# EAGLE design Nixie (EAGLE 6.5.0)
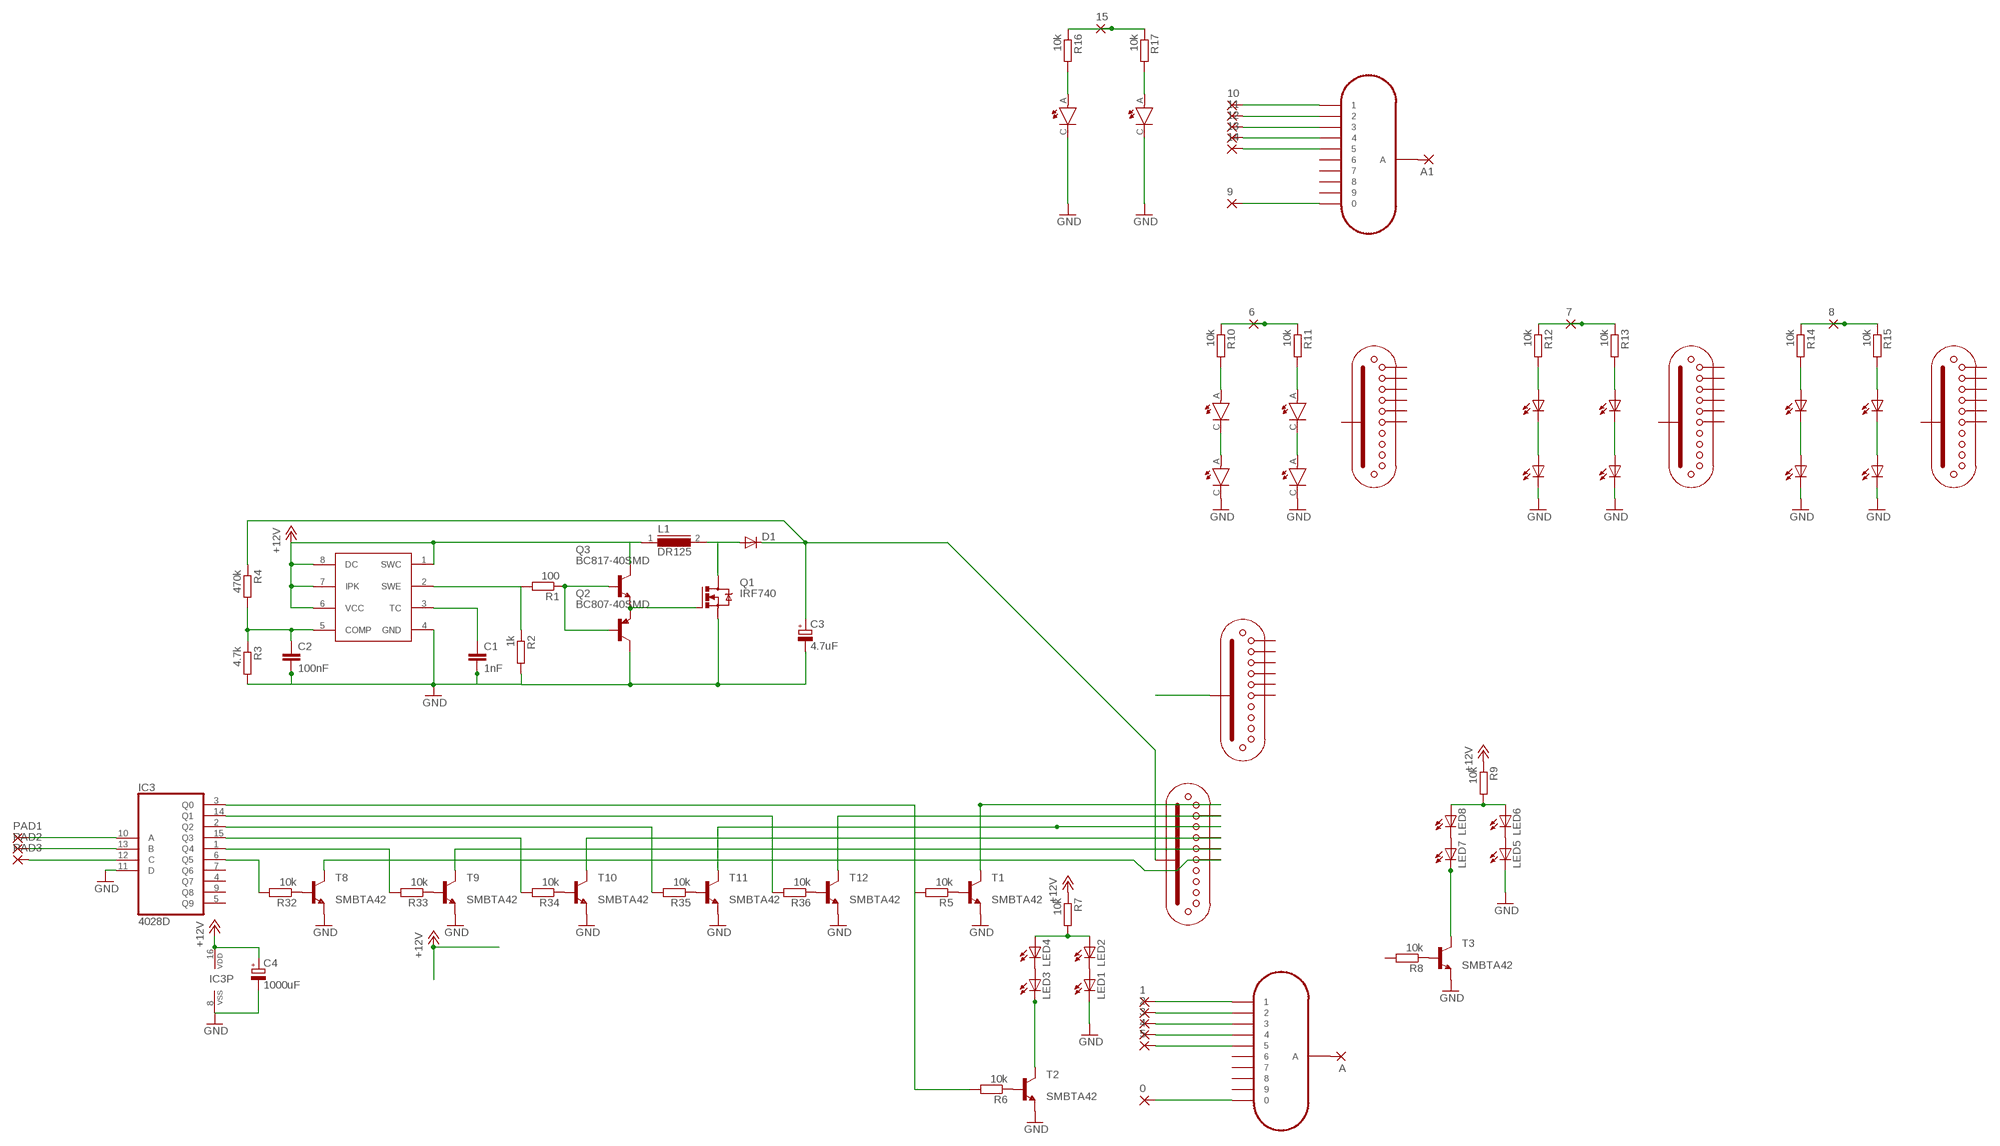
[diagram p0: schematic, sheet 1]

## Parts
0  SMD2  [SMD1,27-2,54]
1  SMD2  [SMD1,27-2,54]
2  SMD2  [SMD1,27-2,54]
3  SMD2  [SMD1,27-2,54]
4  SMD2  [SMD1,27-2,54]
5  SMD2  [SMD1,27-2,54]
6  SMD2  [SMD1,27-2,54]
7  SMD2  [SMD1,27-2,54]
8  SMD2  [SMD1,27-2,54]
9  SMD2  [SMD1,27-2,54]
10  SMD2  [SMD1,27-2,54]
11  SMD2  [SMD1,27-2,54]
12  SMD2  [SMD1,27-2,54]
13  SMD2  [SMD1,27-2,54]
14  SMD2  [SMD1,27-2,54]
15  SMD2  [SMD1,27-2,54]
A  SMD2  [SMD1,27-2,54]
A1  SMD2  [SMD1,27-2,54]
C1  1nF  C-EUC0805K  [C0805K]
C2  100nF  C-EUC0805K  [C0805K]
C3  4.7uF  CPOL-EUE5-10.5  [E5-10,5]
C4  1000uF  CPOL-EUE5-10.5  [E5-10,5]
D1  DIODE-DO214AC  [DO214AC]
IC3  4028D  [SO16]
L1  DR125  [DR125]
LED1  LED3MM  [LED3MM]
LED2  LED3MM  [LED3MM]
LED3  LED3MM  [LED3MM]
LED4  LED3MM  [LED3MM]
LED5  LED3MM  [LED3MM]
LED6  LED3MM  [LED3MM]
LED7  LED3MM  [LED3MM]
LED8  LED3MM  [LED3MM]
LED9  LED_PLCC6  [PLCC6]
LED10  LED_PLCC6  [PLCC6]
LED11  LED_PLCC6  [PLCC6]
LED12  LED_PLCC6  [PLCC6]
LED13  LED_LRTB_G6TG  [PLCC6]
LED14  LED_LRTB_G6TG  [PLCC6]
N1  IN-12A-IN-12  [IN-12]
N2  IN-12A-IN-12  [IN-12]
PAD1  1,6/0,8  [1,6/0,8]
PAD2  1,6/0,8  [1,6/0,8]
PAD3  1,6/0,8  [1,6/0,8]
Q1  IRF740  [TO220BV]
Q2  BC807-40SMD  [SOT23-BEC]
Q3  BC817-40SMD  [SOT23-BEC]
R1  100  R-EU_R0805  [R0805]
R2  1k  R-EU_R0805  [R0805]
R3  4.7k  R-EU_R0805  [R0805]
R4  470k  R-EU_R0805  [R0805]
R5  10k  R-EU_R0805  [R0805]
R6  10k  R-EU_R0805  [R0805]
R7  10k  R-EU_R0805  [R0805]
R8  10k  R-EU_R0805  [R0805]
R9  10k  R-EU_R0805  [R0805]
R10  10k  R-EU_R0805  [R0805]
R11  10k  R-EU_R0805  [R0805]
R12  10k  R-EU_R0805  [R0805]
R13  10k  R-EU_R0805  [R0805]
R14  10k  R-EU_R0805  [R0805]
R15  10k  R-EU_R0805  [R0805]
R16  10k  R-EU_R0805  [R0805]
R17  10k  R-EU_R0805  [R0805]
R32  10k  R-EU_R0805  [R0805]
R33  10k  R-EU_R0805  [R0805]
R34  10k  R-EU_R0805  [R0805]
R35  10k  R-EU_R0805  [R0805]
R36  10k  R-EU_R0805  [R0805]
T1  MMBTA42LT1-NPN-SOT23-BEC  [SOT23-BEC]
T2  MMBTA42LT1-NPN-SOT23-BEC  [SOT23-BEC]
T3  MMBTA42LT1-NPN-SOT23-BEC  [SOT23-BEC]
T8  MMBTA42LT1-NPN-SOT23-BEC  [SOT23-BEC]
T9  MMBTA42LT1-NPN-SOT23-BEC  [SOT23-BEC]
T10  MMBTA42LT1-NPN-SOT23-BEC  [SOT23-BEC]
T11  MMBTA42LT1-NPN-SOT23-BEC  [SOT23-BEC]
T12  MMBTA42LT1-NPN-SOT23-BEC  [SOT23-BEC]
U$1  ZM1020  [ZM1020]
U$2  MC33063/MC34063D  [SO08]
U$3  ZM1020  [ZM1020]
U$4  PLCC2  [PLCC2]
U$5  PLCC2  [PLCC2]
U$6  ZM1020  [ZM1020]
U$7  PLCC2  [PLCC2]
U$8  PLCC2  [PLCC2]
U$9  ZM1020  [ZM1020]
U$10  PLCC2  [PLCC2]
U$11  ZM1020  [ZM1020]
U$12  PLCC2  [PLCC2]

## Nets
+12V: C4.+ IC3.16(VDD) L1.1 Q3.C R7.1 R9.1 U$2.1(SWC) U$2.6(VCC) U$2.7(IPK) U$2.8(DC)
GND: C1.2 C2.2 C3.- C4.- IC3.8(VSS) IC3.11(D) LED1.K(C) LED5.K(C) LED10.C3(C) LED12.C3(C) LED14.C2(G:C) LED14.C3(B:C) Q1.S Q2.C R2.2 R3.2 T1.E T2.E T3.E T8.E T9.E T10.E T11.E T12.E U$2.4(GND) U$7.C U$8.C U$10.C U$12.C
N$1: C1.1 U$2.3(TC)
N$2: IC3.10(A) PAD1.1(P)
N$3: IC3.13(B) PAD2.1(P)
N$4: D1.A L1.2 Q1.D
N$5: C2.1 R3.1 R4.2 U$2.5(COMP)
N$6: IC3.3(Q0) R5.2 R6.2
N$7: R1.2 R2.1 U$2.2(SWE)
N$8: C3.+ D1.C R4.1 U$1.12(A)
N$9: Q1.G Q2.E Q3.E
N$10: Q2.B Q3.B R1.1
N$11: IC3.12(C) PAD3.1(P)
N$12: R5.1 T1.B
N$13: T1.C U$1.11
N$14: LED1.A LED2.K(C)
N$15: LED3.A LED4.K(C)
N$16: U$3.12(A)
N$17: R6.1 T2.B
N$18: R32.1 T8.B
N$19: LED3.K(C) T2.C
N$20: LED2.A LED4.A R7.2
N$21: 0.1(P) N1.0
N$32: 1.1(P) N1.1
N$33: 2.1(P) N1.2
N$34: 3.1(P) N1.3
N$35: 4.1(P) N1.4
N$36: 5.1(P) N1.5
N$37: IC3.14(Q1) R36.2
N$38: IC3.2(Q2) R35.2
N$39: T10.C U$1.3
N$40: A.1(P) N1.A
N$41: LED5.A LED6.K(C)
N$42: LED7.A LED8.K(C)
N$43: R8.1 T3.B
N$44: LED7.K(C) T3.C
N$45: LED6.A LED8.A R9.2
N$50: T9.C U$1.4
N$51: R34.1 T10.B
N$52: U$4.C U$7.A
N$53: U$5.C U$8.A
N$54: R11.2 U$5.A
N$55: R10.2 U$4.A
N$56: R33.1 T9.B
N$57: R35.1 T11.B
N$58: 6.1(P) R10.1 R11.1
N$60: LED11.C3(C) LED12.A3(A)
N$61: IC3.6(Q5) R32.2
N$62: R36.1 T12.B
N$63: T8.C U$1.5
N$64: IC3.1(Q4) R33.2
N$65: IC3.15(Q3) R34.2
N$66: T11.C U$1.2
N$67: T12.C U$1.1
N$68: LED11.A3(A) R13.2
N$69: LED9.A3(A) R12.2
N$70: 7.1(P) R12.1 R13.1
N$79: LED9.C3(C) LED10.A3(A)
N$80: LED13.C2(G:C) LED14.A2(G:A)
N$81: LED13.C3(B:C) LED14.A3(B:A)
N$82: LED13.A3(B:A) R15.2
N$83: LED13.A2(G:A) R14.2
N$84: 8.1(P) R14.1 R15.1
N$87: 9.1(P) N2.0
N$88: 10.1(P) N2.1
N$89: 11.1(P) N2.2
N$90: 12.1(P) N2.3
N$91: 13.1(P) N2.4
N$92: 14.1(P) N2.5
N$93: A1.1(P) N2.A
N$96: R17.2 U$12.A
N$97: R16.2 U$10.A
N$98: 15.1(P) R16.1 R17.1
Unconnected: IC3.4(Q7) IC3.5(Q9) IC3.7(Q6) IC3.9(Q8) LED13.A1(R:A) LED13.C1(R:C) LED14.A1(R:A) LED14.C1(R:C) N1.6 N1.7 N1.8 N1.9 N2.6 N2.7 N2.8 N2.9 R8.2 U$3.1 U$3.2 U$3.3 U$3.4 U$3.5 U$3.11 U$6.1 U$6.2 U$6.3 U$6.4 U$6.5 U$6.11 U$6.12(A) U$9.1 U$9.2 U$9.3 U$9.4 U$9.5 U$9.11 U$9.12(A) U$11.1 U$11.2 U$11.3 U$11.4 U$11.5 U$11.11 U$11.12(A)

## Library data of the parts
0 1-15 A A1 = wirepad:SMD2: SMD PAD
C1 C2 = rcl:C-EU: CAPACITOR, European symbol
C3 C4 = rcl:CPOL-EU: POLARIZED CAPACITOR, European symbol
D1 = diode:DIODE-: DIODE
IC3 = 40xx:4028: BCD to decimal DECODER
L1 = inductors:DR125: High Power Density, High Efficiency, Shielded Inductors Source: coiltronics_dr_series.pdf
LED1-LED8 = led:LED: LED OSRAM: - CHIPLED LG R971, LG N971, LY N971, LG Q971, LY Q971, LO R971, LY R971 LH N974, LH R974 LS Q976, LO Q976, LY Q976 LO Q996 - Hyper CHIPLED LW Q18S LB Q993, LB Q99A, LB R99A - SideLED LS A670, LO A670, LY A670, LG A670, LP A670 LB A673, LV A673, LT A673, LW A673 LH A674 LY A675 LS A676, LA A676, LO A676, LY A676, LW A676 LS A679, LY A679, LG A679 - Hyper Micro SIDELED® LS Y876, LA Y876, LO Y876, LY Y876 LT Y87S - SmartLED LW L88C, LW L88S LB L89C, LB L89S, LG L890 LS L89K, LO L89K, LY L89K LS L896, LA L896, LO L896, LY L896 - TOPLED LS T670, LO T670, LY T670, LG T670, LP T670 LSG T670, LSP T670, LSY T670, LOP T670, LYG T670 LG T671, LOG T671, LSG T671 LB T673, LV T673, LT T673, LW T673 LH T674 LS T676, LA T676, LO T676, LY T676, LB T676, LH T676, LSB T676, LW T676 LB T67C, LV T67C, LT T67C, LS T67K, LO T67K, LY T67K, LW E67C LS E67B, LA E67B, LO E67B, LY E67B, LB E67C, LV E67C, LT E67C LW T67C LS T679, LY T679, LG T679 LS T770, LO T770, LY T770, LG T770, LP T770 LB T773, LV T773, LT T773, LW T773 LH T774 LS E675, LA E675, LY E675, LS T675 LS T776, LA T776, LO T776, LY T776, LB T776 LHGB T686 LT T68C, LB T68C - Hyper Mini TOPLED® LB M676 - Mini TOPLED Santana® LG M470 LS M47K, LO M47K, LY M47K Source: http://www.osram.convergy.de LUXEON: - LUMILED® LXK2-PW12-R00, LXK2-PW12-S00, LXK2-PW14-U00, LXK2-PW14-V00 LXK2-PM12-R00, LXK2-PM12-S00, LXK2-PM14-U00 LXK2-PE12-Q00, LXK2-PE12-R00, LXK2-PE12-S00, LXK2-PE14-T00, LXK2-PE14-U00 LXK2-PB12-K00, LXK2-PB12-L00, LXK2-PB12-M00, LXK2-PB14-N00, LXK2-PB14-P00, LXK2-PB14-Q00 LXK2-PR12-L00, LXK2-PR12-M00, LXK2-PR14-Q00, LXK2-PR14-R00 LXK2-PD12-Q00, LXK2-PD12-R00, LXK2-PD12-S00 LXK2-PH12-R00, LXK2-PH12-S00 LXK2-PL12-P00, LXK2-PL12-Q00, LXK2-PL12-R00 Source: www.luxeon.com KINGBRIGHT: KA-3528ASYC Source: www.kingbright.com
LED9-LED12 = LED_PLCC6:LED_PLCC6
LED13 LED14 = LED_RGB_PLCC6_G6TG:LED_LRTB_G6TG
N1 N2 = IN-12A:IN-12A
PAD1-PAD3 = wirepad:1,6/0,8: THROUGH-HOLE PAD
Q1 = transistor-power:IRF740: N-CHANNEL MOS FET
Q2 = transistor-pnp:BC807*: PNP Transistror
Q3 = transistor-npn:BC817*: NPN Transistor
R1-R17 R32-R36 = rcl:R-EU_: RESISTOR, European symbol
T1-T3 T8-T12 = transistor:*-NPN-: NPN Transistror BF959 corrected 2008.03.06; T: SMBTA42
U$1 U$3 U$6 U$9 U$11 = ZM1020:ZM1020
U$2 = MC33063_MC34063:MC33063/MC34063
U$4 U$5 U$7 U$8 U$10 U$12 = LED_PLCC2:PLCC2

## Board
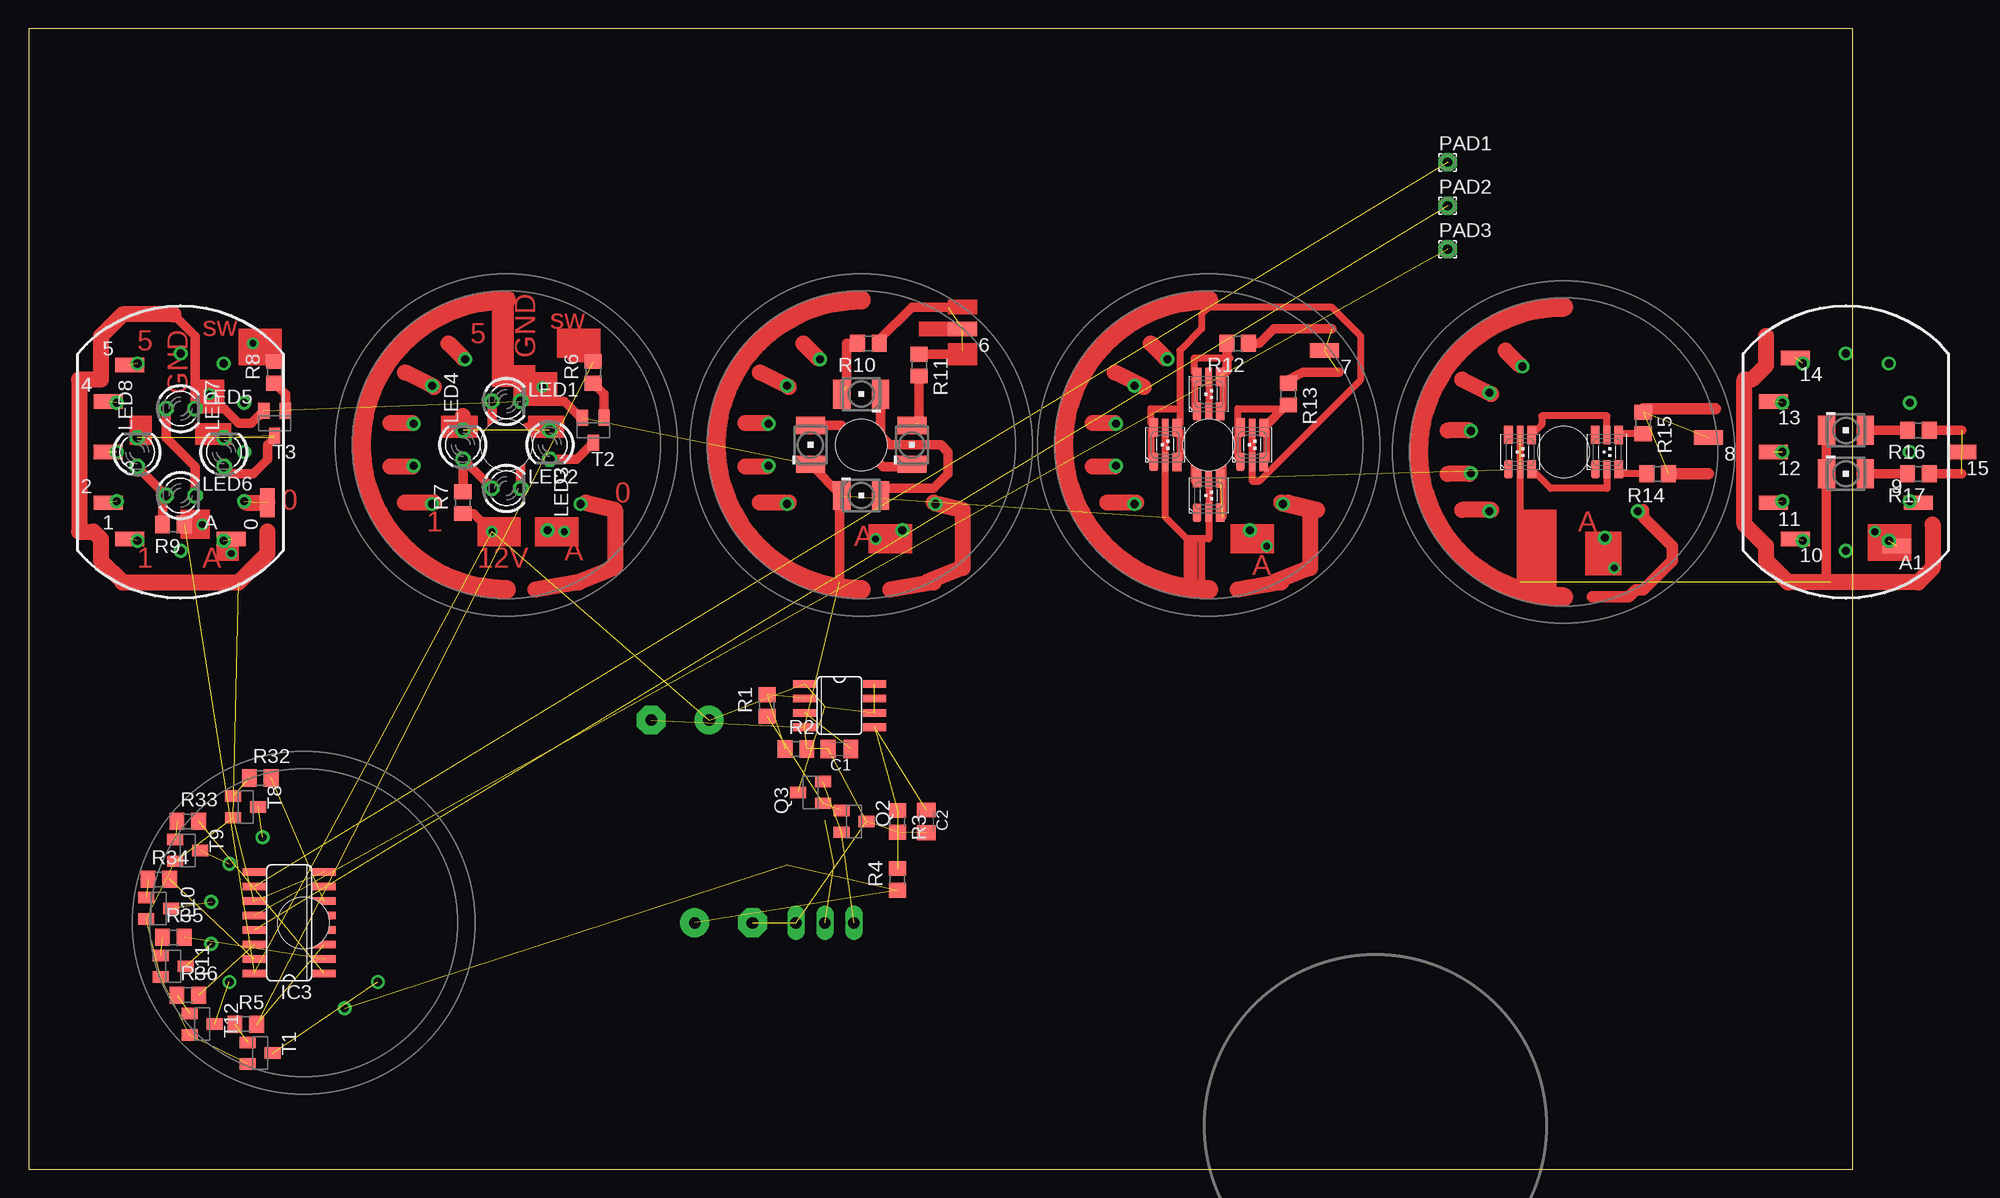
[diagram p1: board, top side]
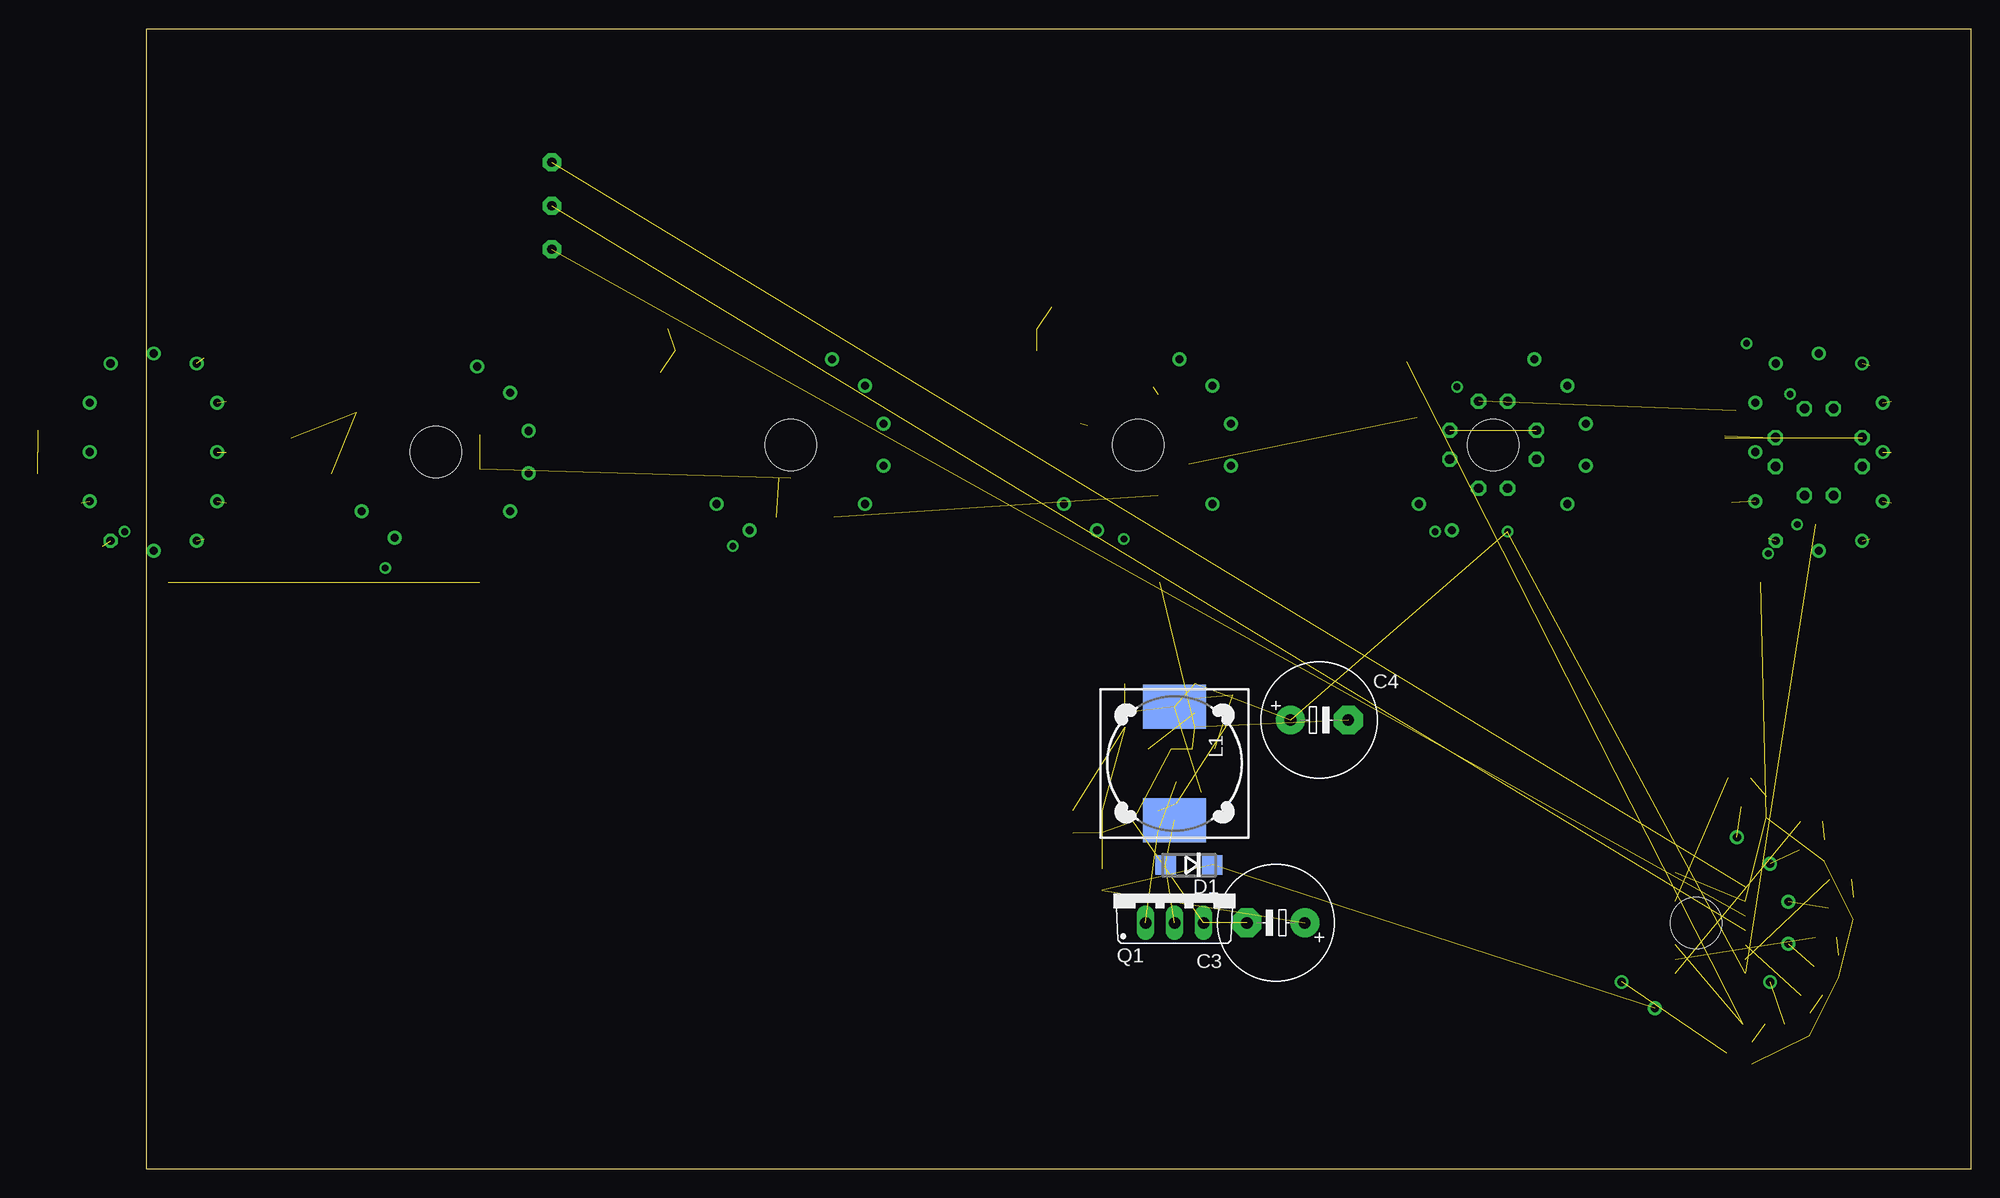
[diagram p2: board, bottom side, seen from below]

Size 160 x 100 mm. Coordinates in mm from the lower left corner, seen from the top.
Outline: 0,0 160,0 160,100 0,100 0,0
Copper layers (1*16): Top 0.035mm / dielectric 1.5mm / Bottom 0.035mm
Design rules "default": minimum track width 10mil, minimum drill 24mil, track to track 8mil, track to pad 8mil, pad to pad 8mil, via to via 8mil, smd to smd 8mil, copper to edge 40mil, drill to drill 8mil, minimum pad ring 10mil, minimum via ring 8mil, stop-mask expansion 4mil, vias tented up to drill 0mil, thermal gap 10mil

### Footprints (pad centres in the part's own frame; a part is rotated, then mirrored left to right if it is on the bottom)
SMD1,27-2,54 = smd 1.27 x 2.54: 1 0,0
C0805K = smd 1.3 x 1.6: 1 -1,0; 2 1,0
E5-10,5 = drill 1.016 pad 2.54: + -2.54,0 | drill 1.016 pad 2.54 octagon: - 2.54,0
DO214AC = smd 1.8 x 1.7: A 2.05,0; C -2.05,0
SO16 = smd 0.66 x 2.032: 1 -4.445,-3.073; 2 -3.175,-3.073; 3 -1.905,-3.073; 4 -0.635,-3.073; 5 0.635,-3.073; 6 1.905,-3.073; 7 3.175,-3.073; 8 4.445,-3.073; 9 4.445,3.073; 10 3.175,3.073; 11 1.905,3.073; 12 0.635,3.073; 13 -0.635,3.073; 14 -1.905,3.073; 15 -3.175,3.073; 16 -4.445,3.073
DR125 = smd 3.85 x 5.5: 1 -4.975,0; 2 4.975,0
LED3MM = drill 0.813 octagon: A -1.27,0; K 1.27,0
PLCC6 = smd 0.75 x 1.6: A1 -1.025,-1.5; A2 1.025,-1.5; A3 1.025,1.5; C1 -1.025,1.525 | smd 0.6 x 1.6: C2 0,-1.5; C3 0,1.5
IN-12 = drill 0.711: 0 5.59,-4.32; 1 -3.78,-7.766; 2 -5.59,-4.32; 3 -5.59,0; 4 -5.59,4.32; 5 -3.78,7.766; 6 0,8.64; 7 3.78,7.766; 8 5.59,4.32; 9 5.59,0; LHDP 0,-8.64 | drill 0.711 octagon: A 3.78,-7.766
1,6/0,8 = drill 0.813 pad 1.6 octagon: 1 0,0
TO220BV = drill 1.016 long: D 0,-2.54; G -2.54,-2.54; S 2.54,-2.54
SOT23-BEC = smd 1 x 1.4: B -0.95,-1.1; C 0,1.1; E 0.95,-1.1
R0805 = smd 1.3 x 1.5: 1 -0.95,0; 2 0.95,0
ZM1020 = drill 0.711: 1 -6.51,-5.19; 2 -8.12,-1.85; 3 -8.12,1.85; 4 -6.51,5.19; 5 -3.61,7.5; 11 6.51,-5.19; 12 3.61,-7.5 | hole 4.5: 0,0
SO08 = smd 0.66 x 2.032: 1 -1.905,-3.073; 2 -0.635,-3.073; 3 0.635,-3.073; 4 1.905,-3.073; 5 1.905,3.073; 6 0.635,3.073; 7 -0.635,3.073; 8 -1.905,3.073
PLCC2 = smd 2.54 x 1.524: A 0,1.702; C 0,-1.702

### Placement (x,y rotation side)
0  20.95,58.42 0 top
1  8.89,55.24 270 top
2  6.99,58.42 270 top
3  6.99,62.87 90 top
4  6.99,67.31 270 top
5  8.89,70.48 270 top
6  81.92,73.66 90 top
7  113.67,71.75 90 top
8  147.32,64.14 90 top
9  165.74,58.42 270 top  (outside the outline)
10  154.94,55.24 90 top
11  153.03,58.42 90 top
12  153.03,62.87 90 top
13  153.03,67.31 90 top
14  154.94,71.12 90 top
15  169.54,62.87 90 top  (outside the outline)
A  17.78,55.24 270 top
A1  163.83,54.61 90 top  (outside the outline)
C1  71.12,36.83 180 top
C2  78.74,30.48 270 top
C3  60.96,21.59 180 bottom
C4  57.15,39.37 0 bottom
D1  68.58,26.67 180 bottom
IC3  22.86,21.59 90 top
L1  69.85,35.56 270 bottom
LED1  41.91,67.31 0 top
LED2  41.91,59.69 0 top
LED3  45.72,63.5 270 top
LED4  38.1,63.5 90 top
LED5  13.34,66.67 0 top
LED6  13.34,59.05 0 top
LED7  17.14,62.87 90 top
LED8  9.53,62.87 90 top
LED9  103.5,67.94 0 top
LED10  103.5,59.05 0 top
LED11  107.31,63.5 0 top
LED12  99.69,63.5 0 top
LED13  138.43,62.87 0 top
LED14  130.81,62.87 0 top
N1  13.34,62.87 0 top
N2  159.38,62.87 0 top
PAD1  124.46,88.27 0 top
PAD2  124.46,84.45 0 top
PAD3  124.46,80.64 0 top
Q1  69.85,24.13 0 bottom
Q2  72.39,30.48 270 top
Q3  68.58,33.02 90 top
R1  64.77,40.64 90 top
R2  67.31,36.83 0 top
R3  76.2,30.48 270 top
R4  76.2,25.4 90 top
R5  19.05,12.7 0 top
R6  49.53,69.85 90 top
R7  38.1,58.42 90 top
R8  21.59,69.85 90 top
R9  12.7,56.52 180 top
R10  73.66,72.39 180 top
R11  78.11,70.48 270 top
R12  106.05,72.39 180 top
R13  110.49,67.94 270 top
R14  142.88,60.96 180 top
R15  141.6,65.41 270 top
R16  165.74,64.77 180 top  (outside the outline)
R17  165.74,60.96 180 top  (outside the outline)
R32  20.32,34.29 0 top
R33  13.97,30.48 0 top
R34  11.43,25.4 0 top
R35  12.7,20.32 0 top
R36  13.97,15.24 0 top
T1  20.32,10.16 270 top
T2  49.53,64.77 180 top
T3  21.59,65.41 180 top
T8  19.05,31.75 270 top
T9  13.97,27.94 270 top
T10  11.43,22.86 270 top
T11  12.7,17.78 270 top
T12  15.24,12.7 270 top
U$1  24.13,21.59 0 top
U$2  71.12,40.64 270 top
U$3  41.91,63.5 0 top
U$4  73.03,67.94 90 top
U$5  77.47,63.5 0 top
U$6  73.03,63.5 0 top
U$7  73.03,59.05 270 top
U$8  68.58,63.5 0 top
U$9  134.62,62.87 0 top
U$10  159.38,64.77 270 top
U$11  103.5,63.5 0 top
U$12  159.38,60.96 270 top

### Tracks (layer width: path | path; a pad name or v marks a point on that pad's centre or on a via)
+12V  (via drill 0.6)  (9 unrouted)
  Top 0.813: R7.1 39.05,57.47 v40.64,55.88
GND  (23 unrouted)
  Top 0.61: LED10.C3 103.5,55.24 102.87,55.24 | 102.87,55.24 102.23,55.24 | 101.6,55.24 99.69,57.15 LED12.C3 | 102.87,55.24 102.87,50.8 102.23,50.8 102.23,55.24 | 102.23,55.24 101.6,55.24 | 101.6,55.24 101.6,51.44 | LED14.C3 130.81,51.44
  Top 0.813: T2.E 48.43,65.87 46.99,67.31 LED1.K | T3.E 19.54,65.41 18.41,65.41 17.14,66.67 LED5.K 14.61,73.03 12.7,74.93 | 71.12,51.44 71.12,59.05 U$7.C U$8.C | U$10.C U$12.C 157.68,51.87 158.12,51.44
  Top 1.422: 12.7,74.93 8.26,74.93 6.35,73.03 6.35,69.22 4.45,69.22 4.45,55.88 5.71,55.88 6.35,55.24 6.35,53.34 8.26,51.44 18.41,51.44 20.95,53.98 20.95,55.88
N$1  (1 unrouted)
N$2  (1 unrouted)
N$3  (1 unrouted)
N$4  (2 unrouted)
N$5  (3 unrouted)
N$6  (2 unrouted)
N$7  (2 unrouted)
N$8  (3 unrouted)
N$9  (2 unrouted)
N$10  (2 unrouted)
N$11  (1 unrouted)
N$12  (1 unrouted)
N$13  (1 unrouted)
N$14
  Top 0.813: LED2.K 43.18,62.23 40.64,64.77 LED1.A
N$15  (1 unrouted)
  Top 1.422: LED4.K 38.1,66.04 | LED3.A 43.81,64.77
N$17
  Top 0.813: T2.B 50.48,67.95 R6.1
N$18  (1 unrouted)
N$19
  Top 0.813: LED3.K 48.09,62.23 T2.C
N$20
  Top 0.813: LED2.A LED4.A R7.2
N$21  (1 unrouted)
  Top 1.422: 19.05,58.42 0.1
N$22  (via drill 0.6)
  other vias: 46.99,55.88 74.3,55.24 108.58,54.61 139.06,52.7 161.93,55.88
N$23
  Top 0.813: 49.53,71.12 47.62,71.12 48.9,71.75
N$24
  Top 1.676: 41.91,50.8 arc-180 41.91,76.2 | 73.03,50.8 arc-180 73.03,76.2 | 103.5,50.8 arc-180 103.5,76.2 | 134.62,50.16 arc-180 134.62,75.56
N$25
  Top 1.422: 38.1,71.12 36.83,72.39 | 69.22,71.12 67.94,72.39 | 99.69,71.12 98.42,72.39 | 130.81,70.48 129.54,71.75
N$26
  Top 1.422: 35.56,68.58 33.02,69.85 | 66.67,68.58 64.14,69.85 | 97.79,68.58 95.25,69.85 | 128.27,67.94 125.73,69.22
N$27
  Top 1.422: 33.66,65.41 31.75,65.41 | 64.77,65.41 62.87,65.41 | 95.25,65.41 93.34,65.41 | 126.36,64.77 124.46,64.77
N$28
  Top 1.422: 33.66,61.59 31.75,61.59 | 64.77,61.59 62.87,61.59 | 95.25,61.59 93.34,61.59 | 126.36,60.96 124.46,60.96
N$29
  Top 1.422: 35.56,58.42 33.02,58.42 | 66.67,58.42 64.14,58.42 | 97.16,58.42 94.61,58.42 | 128.27,57.78 125.73,57.78
N$30
  Top 1.422: 48.9,58.42 51.44,57.78 51.44,52.7 48.26,51.44 44.45,50.8 | 79.38,58.42 81.92,57.78 81.92,52.7 78.74,51.44 | 79.38,51.44 75.56,50.8 | 110.49,58.42 113.03,57.78 | 109.22,51.44 112.39,52.7 112.39,57.78 109.86,58.42 | 109.86,51.44 106.05,50.8
N$31  (via drill 0.6)
  other vias: 45.09,68.58
N$32  (1 unrouted)
N$33  (1 unrouted)
N$34  (1 unrouted)
N$35  (1 unrouted)
N$36  (1 unrouted)
N$37  (1 unrouted)
N$38  (1 unrouted)
N$39  (1 unrouted)
N$40  (1 unrouted)
N$41
  Top 0.813: LED6.K 14.61,61.59 12.06,64.14 LED5.A
N$42  (1 unrouted)
  Top 0.813: LED7.A 17.78,60.96 19.68,60.96 20.95,62.23 20.95,63.5 21.59,64.14
N$43
  Top 0.813: T3.B 22.54,67.95 R8.1
N$44  (1 unrouted)
N$45
  Top 0.813: LED8.A LED6.A 11.75,58.74 R9.2
N$46  (via drill 0.6)
  other vias: 15.24,56.52
N$47  (via drill 0.6)
  other vias: 19.68,72.39
N$48  (via drill 0.6)
  other vias: 15.88,67.94
N$49  (via drill 0.6)
  other vias: 17.78,53.98
N$50  (1 unrouted)
N$51  (1 unrouted)
N$52
  Top 0.813: U$4.C 74.73,64.34 75.56,63.5 80.01,63.5 80.64,62.87 80.64,60.96 79.38,59.69 75.36,59.69 U$7.A
N$53
  Top 0.813: U$8.A 71.32,65.2 74.93,61.59 77.27,61.59 U$5.C
N$54  (1 unrouted)
  Top 0.813: R11.2 78.11,65.41
N$55  (1 unrouted)
  Top 0.813: R10.2 71.75,72.39 71.75,68.58
N$56  (1 unrouted)
N$57  (1 unrouted)
N$58  (2 unrouted)
  Top 0.813: R10.1 74.61,72.7 77.47,75.56 80.64,75.56 | R11.1 81.59,71.44 81.92,71.75
N$59
  Top 1.016: 141.6,57.78 141.6,57.15 144.15,54.61 144.15,53.34 141.6,50.8 140.97,50.8 140.34,50.16 137.16,50.16
N$60
  Top 0.61: LED11.C3 107.31,60.33 107.95,60.33 116.84,69.22 116.84,73.03 114.3,75.56 103.5,75.56 102.87,74.93 102.87,73.66 100.97,71.75 100.97,65.25 LED12.A3
N$61  (1 unrouted)
N$62  (1 unrouted)
N$63  (1 unrouted)
N$64  (1 unrouted)
N$65  (1 unrouted)
N$66  (1 unrouted)
N$67  (1 unrouted)
N$68
  Top 0.813: R13.2 110.33,67 LED11.A3
N$69
  Top 0.813: R12.2 105.09,70.01 LED9.A3
N$70  (2 unrouted)
  Top 0.813: R13.1 110.49,69.22 111.76,69.85 114.94,69.85 | R12.1 107.95,72.39 109.22,73.66 114.3,73.66
N$71
  Top 0.61: 104.78,69.22 104.78,66.67
N$72
  Top 0.61: 102.23,69.22 102.23,66.67
N$73
  Top 0.61: 108.58,64.77 108.58,62.23
N$74
  Top 0.61: 106.05,62.23 106.05,66.67 109.86,66.67
N$75
  Top 0.61: 100.97,64.77 100.97,62.23
N$76
  Top 0.61: 98.42,64.77 98.42,62.23
N$77
  Top 0.61: 102.23,69.85 102.23,71.12 105.41,71.12
N$78
  Top 0.61: 98.42,65.41 98.42,66.67 100.97,66.67 100.97,65.41
N$79  (1 unrouted)
  Top 0.61: 102.23,60.33 102.23,62.23 104.78,62.23 | LED9.C3 103.5,63.5 104.78,62.23 | 104.78,62.23 104.78,57.15
N$80
  Top 0.61: LED13.C2 138.43,59.69 133.51,59.69 LED14.A2
N$81
  Top 0.61: LED13.C3 138.43,66.04 132.72,66.04 132.72,65.25 LED14.A3
N$82
  Top 0.61: R15.2 139.54,64.45 LED13.A3
N$83
  Top 0.61: R14.2 139.86,60.96 LED13.A2
N$84  (2 unrouted)
N$85
  Top 1.016: 144.15,60.96 147.32,60.96
N$86
  Top 1.016: 141.6,66.67 147.96,66.67
N$87  (1 unrouted)
N$88  (1 unrouted)
N$89  (1 unrouted)
N$90  (1 unrouted)
N$91  (1 unrouted)
N$92  (1 unrouted)
N$93  (1 unrouted)
N$94
  Top 1.422: 167,56.52 167,52.7 165.74,51.44 154.31,51.44 152.4,53.34 152.4,54.61 150.5,56.52 150.5,69.22 151.13,69.22 152.4,70.48 152.4,73.03
N$96
  Top 0.813: R17.2 U$12.A
N$97
  Top 0.813: R16.2 U$10.A
N$98  (2 unrouted)
  Top 0.813: R16.1 169.54,64.77 | R17.1 169.54,60.96
(copper drawn outside any net)
  shapes: Top area x22

### Text on the board
Top: sw | sw | 5 | 5 | GND | GND | 0 | 0 | 1 | A | A | 1 | A | 12V | A | A